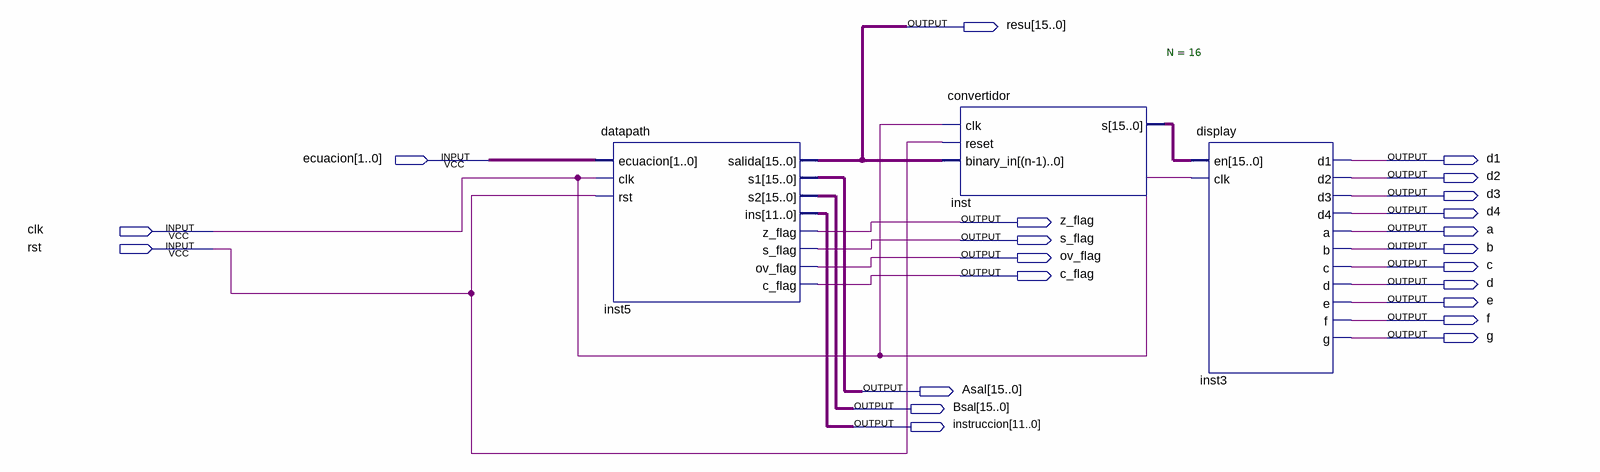
[diagram p0: schematic sheet]
// Quartus schematic practica3.bdf as structural Verilog: 3 symbols, 22 pins
module practica3 (
  input  [1:0] ecuacion,
  input  clk,
  input  rst,
  output [15:0] resu,
  output d1,
  output d2,
  output d3,
  output d4,
  output z_flag,
  output a,
  output s_flag,
  output b,
  output ov_flag,
  output c,
  output c_flag,
  output d,
  output e,
  output f,
  output g,
  output [15:0] Asal,
  output [15:0] Bsal,
  output [11:0] instruccion
);

  wire [15:0] inst_s;

  datapath inst5 (
    .ecuacion(ecuacion), .clk(clk), .rst(rst), .salida(resu), .s1(Asal), .s2(Bsal), .ins(instruccion),
    .z_flag(z_flag), .s_flag(s_flag), .ov_flag(ov_flag), .c_flag(c_flag));
  convertidor #(.N(16)) inst (.clk(clk), .reset(rst), .binary_in(resu), .s(inst_s));
  display inst3 (
    .en(inst_s), .clk(clk), .d1(d1), .d2(d2), .d3(d3), .d4(d4), .a(a), .b(b), .c(c), .d(d), .e(e), .f(f),
    .g(g));
endmodule
